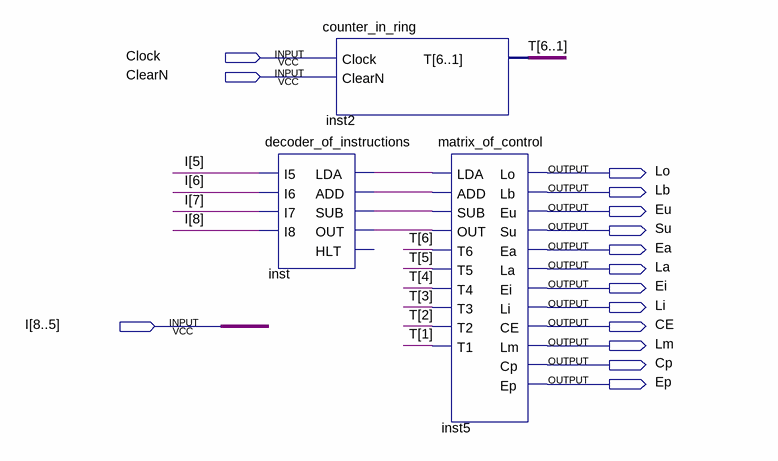
[diagram p0: schematic sheet]
// Quartus schematic controller_sequencer.bdf as structural Verilog: 3 symbols, 15 pins
module controller_sequencer (
  input  Clock,
  input  ClearN,
  input  [8:5] I,
  output Lo,
  output Lb,
  output Eu,
  output Su,
  output Ea,
  output La,
  output Ei,
  output Li,
  output CE,
  output Lm,
  output Cp,
  output Ep
);

  wire inst_add, inst_lda, inst_out, inst_sub;
  wire [6:1] T;

  decoder_of_instructions inst (
    .I5(I[5]), .I6(I[6]), .I7(I[7]), .I8(I[8]), .LDA(inst_lda), .ADD(inst_add), .SUB(inst_sub), .OUT(inst_out));  // open: HLT
  counter_in_ring inst2 (.T(T));  // open: Clock, ClearN
  matrix_of_control inst5 (
    .LDA(inst_lda), .ADD(inst_add), .SUB(inst_sub), .OUT(inst_out), .T6(T[6]), .T5(T[5]), .T4(T[4]),
    .T3(T[3]), .T2(T[2]), .T1(T[1]), .Lo(Lo), .Lb(Lb), .Eu(Eu), .Su(Su), .Ea(Ea), .La(La), .Ei(Ei), .Li(Li),
    .CE(CE), .Lm(Lm), .Cp(Cp), .Ep(Ep));
endmodule
